# EAGLE design Opto-coupler_SMD (EAGLE 8.2.2)
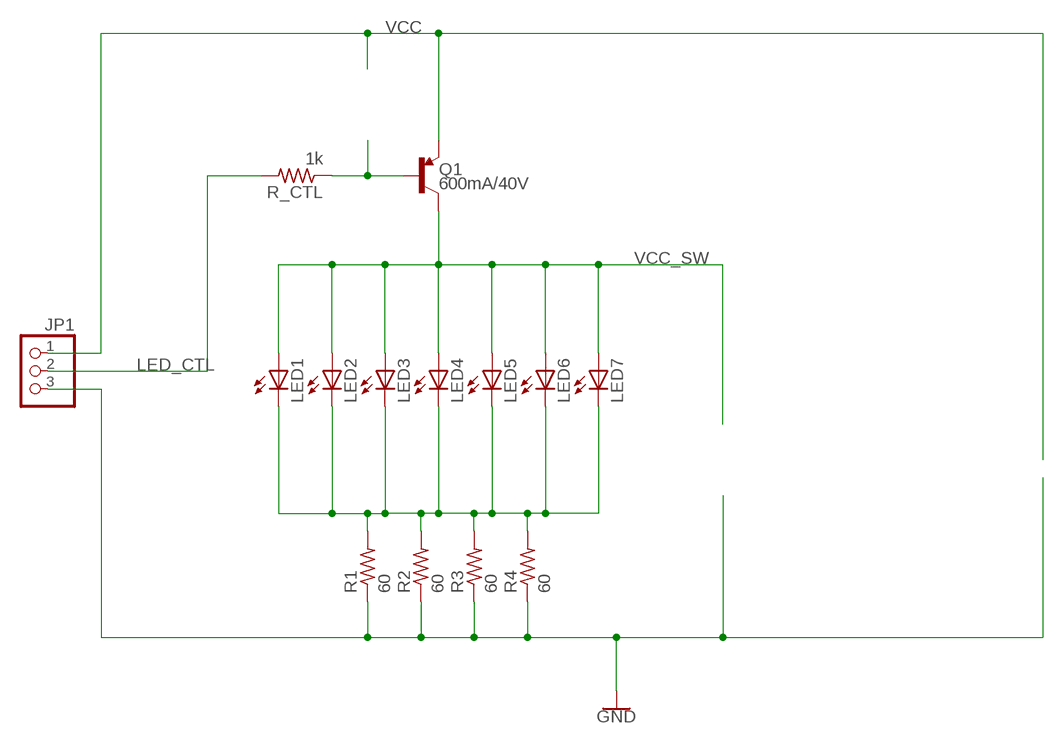
[diagram p0: schematic, sheet 1]

## Parts
JP1  PINHD-1X3  [1X03]
LED1  LEDCHIPLED_0603  [CHIPLED_0603]
LED2  LEDCHIPLED_0603  [CHIPLED_0603]
LED3  LEDCHIPLED_0603  [CHIPLED_0603]
LED4  LEDCHIPLED_0603  [CHIPLED_0603]
LED5  LEDCHIPLED_0603  [CHIPLED_0603]
LED6  LEDCHIPLED_0603  [CHIPLED_0603]
LED7  LEDCHIPLED_0603  [CHIPLED_0603]
Q1  600mA/40V  TRANS_PNP-MMBT4403  [SOT23-3]
R1  60  R-US_R0603  [R0603]
R2  60  R-US_R0603  [R0603]
R3  60  R-US_R0603  [R0603]
R4  60  R-US_R0603  [R0603]
R_CTL  1k  R-US_R0603  [R0603]

## Nets
GND: JP1.3 R1.1 R2.1 R3.1 R4.1
LED_CTL: JP1.2 R_CTL.2
N$1: Q1.1(B) R_CTL.1
N$3: LED1.C LED2.C LED3.C LED4.C LED5.C LED6.C LED7.C R1.2 R2.2 R3.2 R4.2
VCC: JP1.1 Q1.2(E)
VCC_SW: LED1.A LED2.A LED3.A LED4.A LED5.A LED6.A LED7.A Q1.3(C)

## Library data of the parts
JP1 = pinhead:PINHD-1X3: PIN HEADER
LED1-LED7 = adafruit:LED: LED OSRAM: - CHIPLED LG R971, LG N971, LY N971, LG Q971, LY Q971, LO R971, LY R971 LH N974, LH R974 LS Q976, LO Q976, LY Q976 LO Q996 - Hyper CHIPLED LW Q18S LB Q993, LB Q99A, LB R99A - SideLED LS A670, LO A670, LY A670, LG A670, LP A670 LB A673, LV A673, LT A673, LW A673 LH A674 LY A675 LS A676, LA A676, LO A676, LY A676, LW A676 LS A679, LY A679, LG A679 - Hyper Micro SIDELED® LS Y876, LA Y876, LO Y876, LY Y876 LT Y87S - SmartLED LW L88C, LW L88S LB L89C, LB L89S, LG L890 LS L89K, LO L89K, LY L89K LS L896, LA L896, LO L896, LY L896 - TOPLED LS T670, LO T670, LY T670, LG T670, LP T670 LSG T670, LSP T670, LSY T670, LOP T670, LYG T670 LG T671, LOG T671, LSG T671 LB T673, LV T673, LT T673, LW T673 LH T674 LS T676, LA T676, LO T676, LY T676, LB T676, LH T676, LSB T676, LW T676 LB T67C, LV T67C, LT T67C, LS T67K, LO T67K, LY T67K, LW E67C LS E67B, LA E67B, LO E67B, LY E67B, LB E67C, LV E67C, LT E67C LW T67C LS T679, LY T679, LG T679 LS T770, LO T770, LY T770, LG T770, LP T770 LB T773, LV T773, LT T773, LW T773 LH T774 LS E675, LA E675, LY E675, LS T675 LS T776, LA T776, LO T776, LY T776, LB T776 LHGB T686 LT T68C, LB T68C - Hyper Mini TOPLED® LB M676 - Mini TOPLED Santana® LG M470 LS M47K, LO M47K, LY M47K Source: http://www.osram.convergy.de/
Q1 = SparkFun-DiscreteSemi:TRANS_PNP: PNP transistor Current controlled devices typically used to amplify current or used as a switch. SparkFun Products: SparkFun Serial Enabled 16x2 LCD - Red on Black <https://www.sparkfun.com/products/9068> SparkFun Logomatic <https://www.sparkfun.com/products/12772>; PROD_ID: TRANS-09245
R1-R4 R_CTL = adafruit:R-US_: RESISTOR, American symbol

## Board
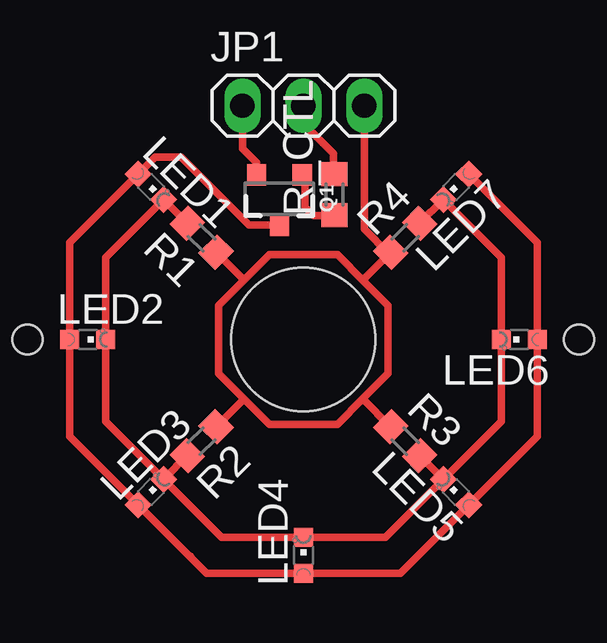
[diagram p1: board, top side]

No outline drawn. Coordinates in mm, seen from the top.
Copper layers (1*16): Top 0.035mm / dielectric 1.5mm / Bottom 0.035mm
Design rules "OthermillDRC_1_64_v2": minimum track width 16mil, minimum drill 31mil, track to track 0.39878125mm, track to pad 0.39878125mm, pad to pad 0.39878125mm, via to via 0.39878125mm, smd to smd 0mil, copper to edge 0mil, drill to drill 1mil, minimum pad ring 0mil, minimum via ring 15mil, stop-mask expansion 1mil, vias tented up to drill 30mil, thermal gap 10mil
Holes 6 mm at 11.5,11.5
Holes 1.25 mm at 23,11.5 0,11.5

### Footprints (pad centres in the part's own frame; a part is rotated, then mirrored left to right if it is on the bottom)
1X03 = drill 1.016 long: 1 -2.54,0; 2 0,0; 3 2.54,0
CHIPLED_0603 = smd 0.8 x 0.8: A 0,-0.75; C 0,0.75
SOT23-3 = smd 0.8 x 0.9: 1 -0.95,-1; 2 0.95,-1; 3 0,1.1
R0603 = smd 1 x 1.1: 1 -0.85,0; 2 0.85,0

### Placement (x,y rotation side)
JP1  11.5,21.25 0 top
LED1  5.14,17.86 225 top
LED2  2.5,11.5 270 top
LED3  5.14,5.14 315 top
LED4  11.5,2.5 0 top
LED5  17.86,5.14 45 top
LED6  20.5,11.5 90 top
LED7  17.86,17.86 135 top
Q1  10.5,17.36 180 top
R1  7.26,15.74 135 top
R2  7.26,7.26 225 top
R3  15.74,7.26 315 top
R4  15.74,15.74 45 top
R_CTL  12.8,17.54 90 top

### Tracks (layer width: path | path; a pad name or v marks a point on that pad's centre or on a via)
GND
  Top 0.305: 15.07,15.07 15.04,15.04 | 15.07,15.07 R4.1 15.07,15.07 | 8.96,13.91 7.96,12.91 7.96,10.09 9,9.05 | 8.96,13.91 10.09,15.04 12.91,15.04 14.01,13.94 | 14.01,13.94 15.04,12.91 15.04,10.09 13.99,9.04 | 13.99,9.04 12.91,7.96 10.09,7.96 9,9.05 | R1.1 8.96,14.04 8.96,13.91 | R2.1 9,9 9,9.05 | 15.07,15.07 14.01,14.01 14.01,13.94 | R3.1 13.99,9.01 13.99,9.04 | JP1.3 14.04,16.09 15.07,15.07
LED_CTL
  Top 0.305: R_CTL.2 12.8,18.7 12.75,18.75 12.75,19.25 11.5,20.5 JP1.2
N$1
  Top 0.305: R_CTL.1 12.76,16.66 11.91,16.66 11.56,17.01 11.56,18.25 Q1.1
N$3
  Top 0.305: 5.65,5.68 LED3.C 8.08,3.25 LED4.C 14.92,3.25 LED5.C | 5.65,5.68 3.25,8.08 LED2.C 3.25,14.92 LED1.C R1.2 | LED5.C 19.75,8.08 LED6.C 19.75,14.92 LED7.C R4.2 | R2.2 5.68,5.68 5.65,5.68 | R3.2 LED5.C
VCC
  Top 0.305: JP1.1 8.96,19.45 9.55,18.86 Q1.2
VCC_SW
  Top 0.305: 6.8,2.42 LED3.A 1.75,7.46 LED2.A 1.75,15.54 LED1.A 5.31,19.1 6.4,19.1 9.24,16.26 Q1.3 10.46,16.3 | 6.8,2.42 7.46,1.75 LED4.A 15.54,1.75 LED5.A 21.25,7.46 LED6.A 21.25,15.54 LED7.A | 6.8,2.45 6.8,2.42